# Altium schematic sheet Amplifier_Sheet.SchDoc
size A; SheetNumber: 4; SheetTotal: 6
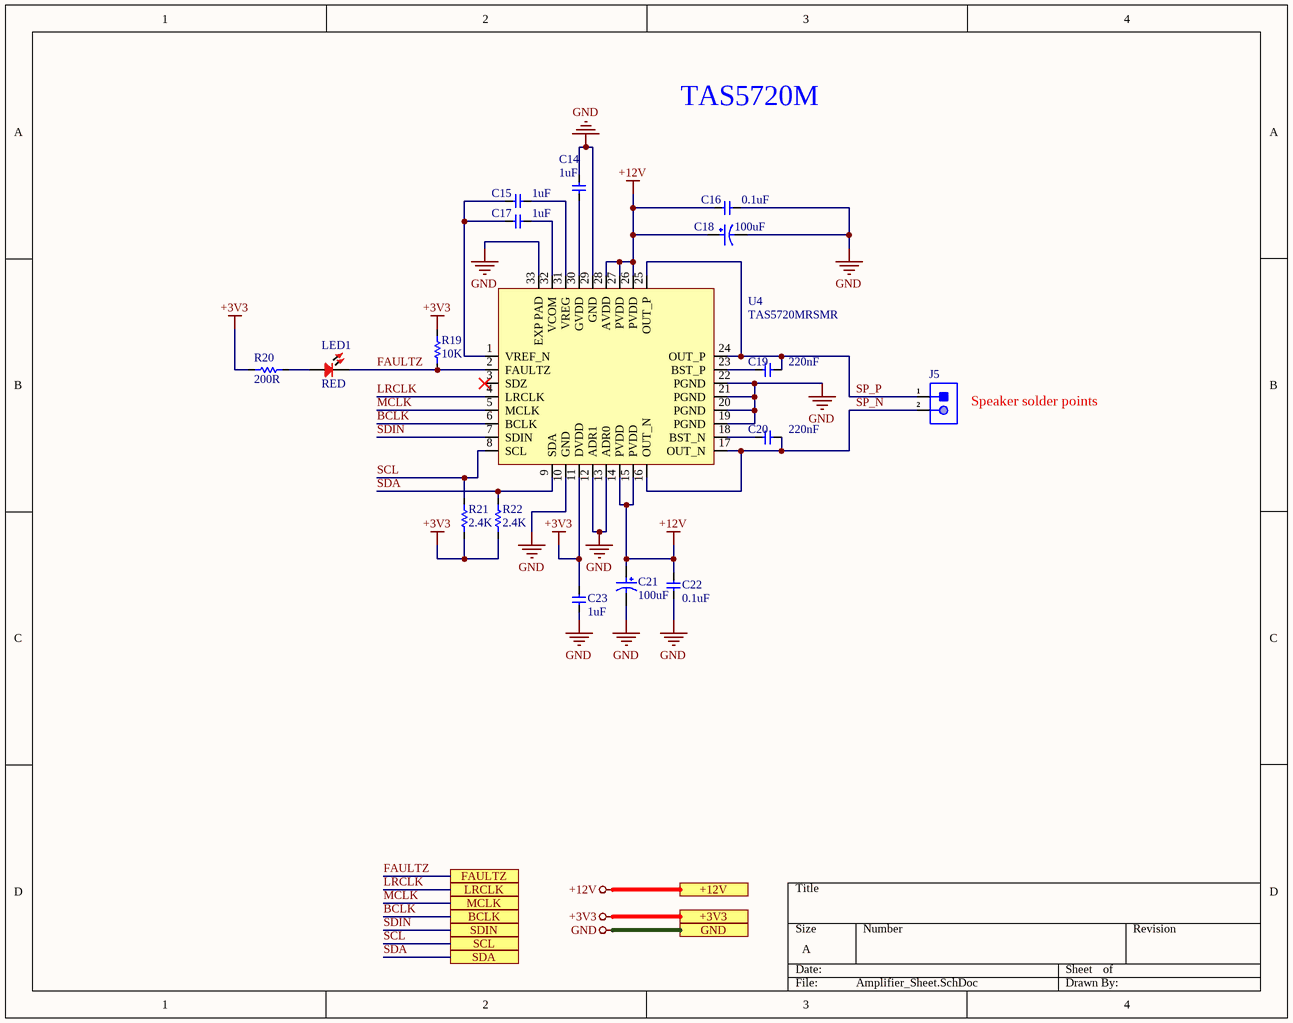
[diagram p0: Amplifier_Sheet.SchDoc]

## Parts
C14  1uF  [Cap-0603]
C15  1uF  [Cap-0603]
C16  0.1uF  [Cap-0603]
C17  1uF  [Cap-0603]
C18  100uF  [RVT1H101M0607]
C19  220nF  [Cap-0402]
C20  220nF  [Cap-0402]
C21  100uF  [RVT1H101M0607]
C22  0.1uF  [Cap-0603]
C23  1uF  [Cap-0603]
J5  2P THrough Hole Pads  [2P THrough Hole Pads]  (value not drawn)
LED1  RED  [LED-0603]
R19  10K  [Res-0603]
R20  200R  [Res-0402]
R21  2.4K  [Res-0402]
R22  2.4K  [Res-0402]
U4  TAS5720MRSMR  [TAS5720M]

## Ports
+3V3 (see Top_Sheet[1B], Controller_Sheet[3D], LCD_Sheet[3D], Power_Sheet[3D], Sensor_Sheet[3D]), +12V (see Top_Sheet[1B], Power_Sheet[3D], Sensor_Sheet[3D]), BCLK (see Top_Sheet[2B], Controller_Sheet[2D]), FAULTZ (see Top_Sheet[2B], Controller_Sheet[2D]), GND (see Top_Sheet[1B], Controller_Sheet[3D], LCD_Sheet[3D], Power_Sheet[3D], Sensor_Sheet[3D]), LRCLK (see Top_Sheet[2B], Controller_Sheet[2D]), MCLK (see Top_Sheet[2B], Controller_Sheet[2D]), SCL (see Top_Sheet[2B], Controller_Sheet[1D], LCD_Sheet[1D], Sensor_Sheet[2D]), SDA (see Top_Sheet[2B], Controller_Sheet[1D], LCD_Sheet[1D], Sensor_Sheet[2D]), SDIN (see Top_Sheet[2B], Controller_Sheet[2D])

## Nets
+3V3: C23.2 R19.1 R20.1 R21.1 R22.1 U4.11(DVDD) ; port +3V3
+12V: C16.1 C18.1 C21.1 C22.1 U4.14(PVDD) U4.15(PVDD) U4.26(PVDD) U4.27(PVDD) U4.28(AVDD) ; port +12V
GND: C14.2 C16.2 C18.2 C21.2 C22.2 C23.1 U4.10(GND) U4.12(ADR1) U4.13(ADR0) U4.19(PGND) U4.20(PGND) U4.21(PGND) U4.22(PGND) U4.29(GND) U4.33(EXP_PAD) ; port GND
BCLK: U4.6(BCLK) ; port BCLK
FAULTZ: LED1.2 R19.2 U4.2(FAULTZ) ; port FAULTZ
LRCLK: U4.4(LRCLK) ; port LRCLK
MCLK: U4.5(MCLK) ; port MCLK
SCL: R21.2 U4.8(SCL) ; port SCL
SDA: R22.2 U4.9(SDA) ; port SDA
SDIN: U4.7(SDIN) ; port SDIN
SP_N: C20.2 J5.2 U4.16(OUT_N) U4.17(OUT_N)
SP_P: C19.2 J5.1 U4.24(OUT_P) U4.25(OUT_P)
NetC14_1: C14.1 U4.30(GVDD)
NetC15_1: C15.1 C17.1 U4.1(VREF_N)
NetC15_2: C15.2 U4.31(VREG)
NetC17_2: C17.2 U4.32(VCOM)
NetC19_1: C19.1 U4.23(BST_P)
NetC20_1: C20.1 U4.18(BST_N)
NetLED1_1: LED1.1 R20.2

Not connected (* = marked no-connect by the designer): U4 3(SDZ)*

## Notes on the sheet
- TAS5720M
- (near J5) Speaker solder points

## Library data of the parts
C14 C15 C17 C23 = CC0603KRX5R8BB105: CAP CER 1UF 25V X5R 0603; Manufacturer: Yageo; Tolerance: 10%; Item Type: Capacitor; Supplier 1: Digi-Key; Manufacturer Part Number: CC0603KRX5R8BB105; RoHS: Yes; Category: Ceramic Capacitors; Stock 1: 919939; Pricing 1: 1=0.12000, 10=0.08400, 50=0.04760, 100=0.03940, 500=0.02764, 1000=0.02288 (USD); Mount: Surface Mount; Case/Package: 0603; Number of Pins: 2; Case Code (Metric): 1608; Case Code (Imperial): 0603; Min Operating Temperature: -55°C; Max Operating Temperature: 85°C; Capacitance: 1uF; Dielectric: X5R; Package Quantity: 1; Voltage Rating: 25V; Packaging: Tape and Reel; Termination: SMD/SMT; Voltage Rating (DC): 25V; Series: CC; Construction: Flat; Length: 1.6mm; Width: 0.031inch; Height: 0.8mm; Thickness: 0.035inch; Depth: 0.8mm; Radiation Hardening: No; REACH SVHC: No SVHC; Lead Free: Lead Free; Halogen Free: Halogen Free; RoHS Compliant: Yes; ComponentLink1URL: https://datasheet.ciiva.com/176/mlccorderingcode-176785.pdf?src-supplier=Digi-Key; ComponentLink1Description: https://datasheet.ciiva.com/176/mlccorderingcode-176785.pdf?src-supplier=Digi-Key; ComponentLink2URL: https://datasheet.ciiva.com/176/mlccorderingcode-176786.pdf?src-supplier=Digi-Key; ComponentLink2Description: https://datasheet.ciiva.com/176/mlccorderingcode-176786.pdf?src-supplier=Digi-Key; ComponentLink3URL: https://datasheet.ciiva.com/176/mlccorderingcode-176787.pdf?src-supplier=Digi-Key; ComponentLink3Description: https://datasheet.ciiva.com/176/mlccorderingcode-176787.pdf?src-supplier=Digi-Key; ComponentLink4URL: https://datasheet.ciiva.com/17436/upy-gphc-x5r-4v-to-50v-12-17436952.pdf?src-supplier=Avnet+Europe; ComponentLink4Description: https://datasheet.ciiva.com/17436/upy-gphc-x5r-4v-to-50v-12-17436952.pdf?src-supplier=Avnet+Europe; ComponentLink5URL: https://datasheet.ciiva.com/7978/1525783-7978171.pdf?src-supplier=Element14; ComponentLink5Description: https://datasheet.ciiva.com/7978/1525783-7978171.pdf?src-supplier=Element14; ComponentLink6URL: https://datasheet.ciiva.com/11586/upy-gphc-x5r-4v-to-50v-12-11586318.pdf?src-supplier=Avnet; ComponentLink6Description: https://datasheet.ciiva.com/11586/upy-gphc-x5r-4v-to-50v-12-11586318.pdf?src-supplier=Avnet; Supplier Part Number 1: 311-1445-1-ND; LCSC Part Number: C14664
C16 C22 = CC0603KRX7R0BB104: CAP CER 0.1UF 100V X7R 0603; Manufacturer: Yageo; Capacitance: 100nF; Tolerance: 10%; Item Type: Capacitor; Supplier 1: Digi-Key; Manufacturer Part Number: CC0603KRX7R0BB104; RoHS: Yes; Category: Ceramic Capacitors; Stock 1: 60476; Pricing 1: 1=0.19000, 10=0.13500, 50=0.07680, 100=0.06370, 500=0.04466, 1000=0.03696 (USD); Mount: Surface Mount; Case/Package: 0603; Case Code (Metric): 1608; Case Code (Imperial): 0603; Weight: 7.1E-05oz; Min Operating Temperature: -55°C; Max Operating Temperature: 125°C; Package Quantity: 4000; Voltage Rating: 100V; Packaging: Tape and Reel; Dielectric: X7R; Termination: SMD/SMT; Resistor Type: Ceramic; Voltage Rating (DC): 100V; Series: CC; Length: 0.063inch; Width: 0.031inch; Thickness: 0.035inch; Depth: 0.8mm; Lead Free: Lead Free; RoHS Compliant: Yes; ComponentLink1URL: https://datasheet.ciiva.com/6277/mlccorderingcode-6277030.pdf?src-supplier=Digi-Key; ComponentLink1Description: https://datasheet.ciiva.com/6277/mlccorderingcode-6277030.pdf?src-supplier=Digi-Key; ComponentLink2URL: https://datasheet.ciiva.com/6277/mlccorderingcode-6277081.pdf?src-supplier=Digi-Key; ComponentLink2Description: https://datasheet.ciiva.com/6277/mlccorderingcode-6277081.pdf?src-supplier=Digi-Key; ComponentLink3URL: https://datasheet.ciiva.com/6277/mlccorderingcode-6277082.pdf?src-supplier=Digi-Key; ComponentLink3Description: https://datasheet.ciiva.com/6277/mlccorderingcode-6277082.pdf?src-supplier=Digi-Key; Supplier Part Number 1: 311-1523-1-ND; LCSC Part Number: C113803
C18 C21 = RVT1H101M0607: 100uF 50V ±20% SMD,D6.3xL7.7mm Aluminum Electrolytic Capacitors - SMD ROHS; Manufacturer: ROQANG; Manufacturer Part Number: RVT1H101M0607; Package: SMD,D6.3xL7.7mm; LCSC Part Number: C3151829; Item Type: Capacitor; ComponentLink1Description: LCSC; ComponentLink1URL: https://www.lcsc.com/product-detail/Aluminum-Electrolytic-Capacitors-SMD_ROQANG-RVT1H101M0607_C3151829.html
C19 C20 = CC0402KRX5R8BB224: CAP CER 0.22UF 25V X5R 0402; Manufacturer: Yageo; Tolerance: 10%; Supplier 1: Mouser; Manufacturer Part Number: CC0402KRX5R8BB224; RoHS: Yes; Category: Ceramic Capacitors; Stock 1: 61266; Pricing 1: 1=0.10000, 10=0.03300, 50=0.03300, 100=0.02700, 1000=0.01500, 10000=0.01300 (USD); Mount: Surface Mount; Case/Package: 0402; Min Operating Temperature: -55°C; Max Operating Temperature: 85°C; Packaging: Tape and Reel; Capacitance: 220nF; Voltage Rating: 25V; Voltage Rating (DC): 25V; Dielectric: X5R; Length: 0.039inch; Width: 0.02inch; Thickness: 0.022inch; Lead Free: Lead Free; Halogen Free: Halogen Free; RoHS Compliant: Yes; ComponentLink1URL: http://www.yageo.com/documents/recent/UPY-GPHC_X5R_4V-to-50V_25.pdf?src-supplier=Digi-Key; ComponentLink1Description: http://www.yageo.com/documents/recent/UPY-GPHC_X5R_4V-to-50V_25.pdf?src-supplier=Digi-Key; ComponentLink2URL: https://www.yageo.com/upload/media/product/productsearch/datasheet/mlcc/UPY-GPHC_X5R_4V-to-50V_26.pdf?src-supplier=Digi-Key; ComponentLink2Description: https://www.yageo.com/upload/media/product/productsearch/datasheet/mlcc/UPY-GPHC_X5R_4V-to-50V_26.pdf?src-supplier=Digi-Key; ComponentLink3URL: http://www.yageo.com/documents/recent/UPY-GPHC_X5R_4V-to-50V_23.pdf?src-supplier=Digi-Key; ComponentLink3Description: http://www.yageo.com/documents/recent/UPY-GPHC_X5R_4V-to-50V_23.pdf?src-supplier=Digi-Key; Supplier Part Number 1: 603-CC402KRX5R8BB224; LCSC Part Number: C326836
J5 = 2P THrough Hole Pads: Wire Connecting Pad; Manufacturer Part Number: 2P THrough Hole Pads; Item Type: THrough Hole Pads
LED1 = NCD0603R3: RED LED 0603 Light Emitting Diodes; Manufacturer: Foshan NationStar Optoelectronics; Manufacturer Part Number: NCD0603R3; Package: 0603; Item Type: LED; LCSC Part Number: C3151730; ComponentLink1Description: LCSC; ComponentLink1URL: https://www.lcsc.com/product-detail/Light-Emitting-Diodes-LED_Foshan-NationStar-Optoelectronics-NCD0603R3_C3151730.html
R19 = RT0603BRD0710KL: RES SMD 10K OHM 0.1% 1/10W 0603; Manufacturer: Yageo; Power: 100mW; Rated Temperature: 70°C; Value: 10kR; Temperature Coefficient: 25ppm/°C; Working Voltage: 75V; Package Height: 0.45mm; Package Length: 1.6mm; Package Width: 0.8mm; Item Type: Resistor; Supplier 1: Rs; Manufacturer Part Number: RT0603BRD0710KL; RoHS: Yes; Category: Chip SMD Resistors; Stock 1: 20510; Pricing 1: 100=0.29800, 250=0.27800, 500=0.25900, 1000=0.23700 (GBP); Mounting Technology: Surface Mount; Pins: 2; Case/Package: 0603; Min Operating Temperature: -55°C; Max Operating Temperature: 155°C; Tolerance: 0.1%; Resistor Type: FIXED RESISTOR; Construction: Chip; Package Style: SMTMeter; Packaging: Tape and Reel; Technology: THIN FILM; Termination: Wraparound; Reach SVHC Compliant: Yes; RoHS Compliant: Yes; ComponentLink1URL: https://datasheet.ciiva.com:443/pdfs/VipMasterIC/IC/YAGO/YAGO-S-A0008510989/YAGO-S-A0008510989-1.pdf?src-supplier=IHS+Markit; ComponentLink1Description: https://datasheet.ciiva.com:443/pdfs/VipMasterIC/IC/YAGO/YAGO-S-A0008510989/YAGO-S-A0008510989-1.pdf?src-supplier=IHS+Markit; ComponentLink2URL: https://datasheet.ciiva.com/5624/pyu-rt-1-to-0-05-rohs-l-4-5624351.pdf?src-supplier=Mouser; ComponentLink2Description: https://datasheet.ciiva.com/5624/pyu-rt-1-to-0-05-rohs-l-4-5624351.pdf?src-supplier=Mouser; ComponentLink3URL: https://datasheet.ciiva.com/29721/pyu-rt-1-to-0-05-rohs-l-4-29721177.pdf?src-supplier=Digi-Key; ComponentLink3Description: https://datasheet.ciiva.com/29721/pyu-rt-1-to-0-05-rohs-l-4-29721177.pdf?src-supplier=Digi-Key; Supplier Part Number 1: 1991391P; LCSC Part Number: C95204
R20 = FRC0402F2000TS: 62.5mW Thick Film Resistors 50V ±100ppm/℃ ±1% 200Ω 0402 Chip Resistor - Surface Mount ROHS; Manufacturer: FOJAN; Manufacturer Part Number: FRC0402F2000TS; LCSC Part Number: C2909333; Item Type: Resistor; Package: 0402; ComponentLink1Description: LCSC Link; ComponentLink1URL: https://www.lcsc.com/product-detail/Chip-Resistor-Surface-Mount_FOJAN-FRC0402F2000TS_C2909333.html
R21 R22 = 0402WGF2401TCE: 62.5mW Thick Film Resistors 50V ±100ppm/℃ ±1% 2.4kΩ 0402 Chip Resistor - Surface Mount ROHS; Manufacturer: UNI ROYAL; Manufacturer Part Number: 0402WGF2401TCE; LCSC Part Number: C25882; Item Type: Resistor; Package: 0402; ComponentLink1Description: LCSC Link; ComponentLink1URL: https://www.lcsc.com/product-detail/Chip-Resistor-Surface-Mount_UNI-ROYAL-Uniroyal-Elec-0402WGF2401TCE_C25882.html
U4 = TAS5720MRSMR: 20Wx1@4Ω VQFN-32(4x4) Audio Power OpAmps ROHS; Manufacturer: Texas Instruments; Item Type: Audio Amp; Manufacturer Part number: TAS5720MRSMR; LCSC Part Number: C5214961; ComponentLink1Description: LCSC Link; ComponentLink1URL: https://www.lcsc.com/product-detail/Audio-Power-OpAmps_Texas-Instruments-TAS5720MRSMR_C5214961.html; Package: VQFN-32(4x4)